# EAGLE design Transceiver (EAGLE 5.00)
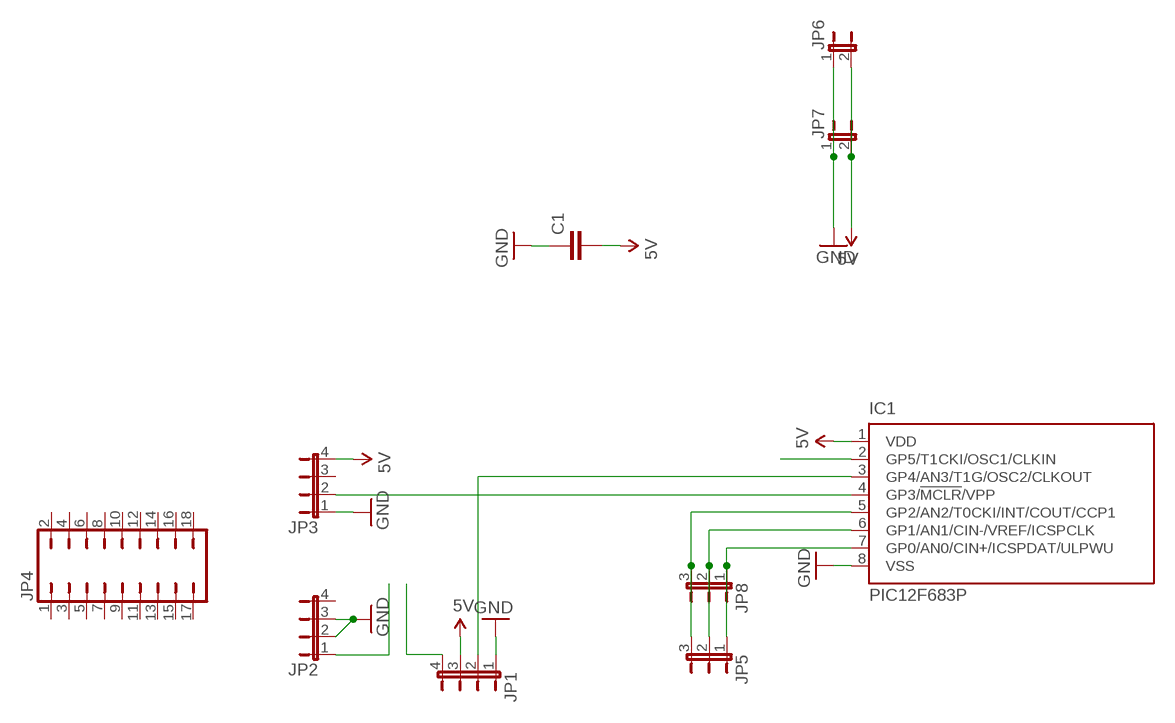
[diagram p0: schematic, sheet 1]

## Parts
C1  C-EU050-025X075  [C050-025X075]
IC1  PIC12F683P  [DIL8]
JP1  JP4E  [JP4]
JP2  JP4E  [JP4]
JP3  JP4E  [JP4]
JP4  JP9Q  [JP9Q]
JP5  JP2E  [JP2]
JP6  JP1E  [JP1]
JP7  JP1E  [JP1]
JP8  JP2E  [JP2]

## Nets
5V: C1.2 IC1.1(VDD) JP1.3 JP3.4 JP6.2 JP7.2
GND: C1.1 IC1.8(VSS) JP1.1 JP2.2 JP2.3 JP3.1 JP6.1 JP7.1
N$1: IC1.3(GP4/AN3/T1G/OSC2/CLKOUT) JP1.2
N$2: IC1.4(GP3/!MCLR!/VPP) JP3.2
N$3: IC1.5(GP2/AN2/T0CKI/INT/COUT/CCP1) JP5.3 JP8.3
N$4: IC1.6(GP1/AN1/CIN-/VREF/ICSPCLK) JP5.2 JP8.2
N$5: IC1.7(GP0/AN0/CIN+/ICSPDAT/ULPWU) JP5.1 JP8.1
N$6: IC1.2(GP5/T1CKI/OSC1/CLKIN)
N$7: JP2.1
N$8: JP1.4
Unconnected: JP2.4 JP3.3 JP4.1 JP4.2 JP4.3 JP4.4 JP4.5 JP4.6 JP4.7 JP4.8 JP4.9 JP4.10 JP4.11 JP4.12 JP4.13 JP4.14 JP4.15 JP4.16 JP4.17 JP4.18

## Library data of the parts
C1 = rcl:C-EU: CAPACITOR, European symbol
IC1 = microchip-6:PIC12F683: 8-Pin Flash-Based, 8-Bit CMOS Microcontrollers with nanoWatt Technology Source: http://ww1.microchip.com/downloads/en/DeviceDoc/41211D_.pdf
JP1-JP3 = jumper:JP4E: JUMPER
JP4 = jumper:JP9Q: JUMPER
JP5 JP8 = jumper:JP2E: JUMPER
JP6 JP7 = jumper:JP1E: JUMPER

## Board
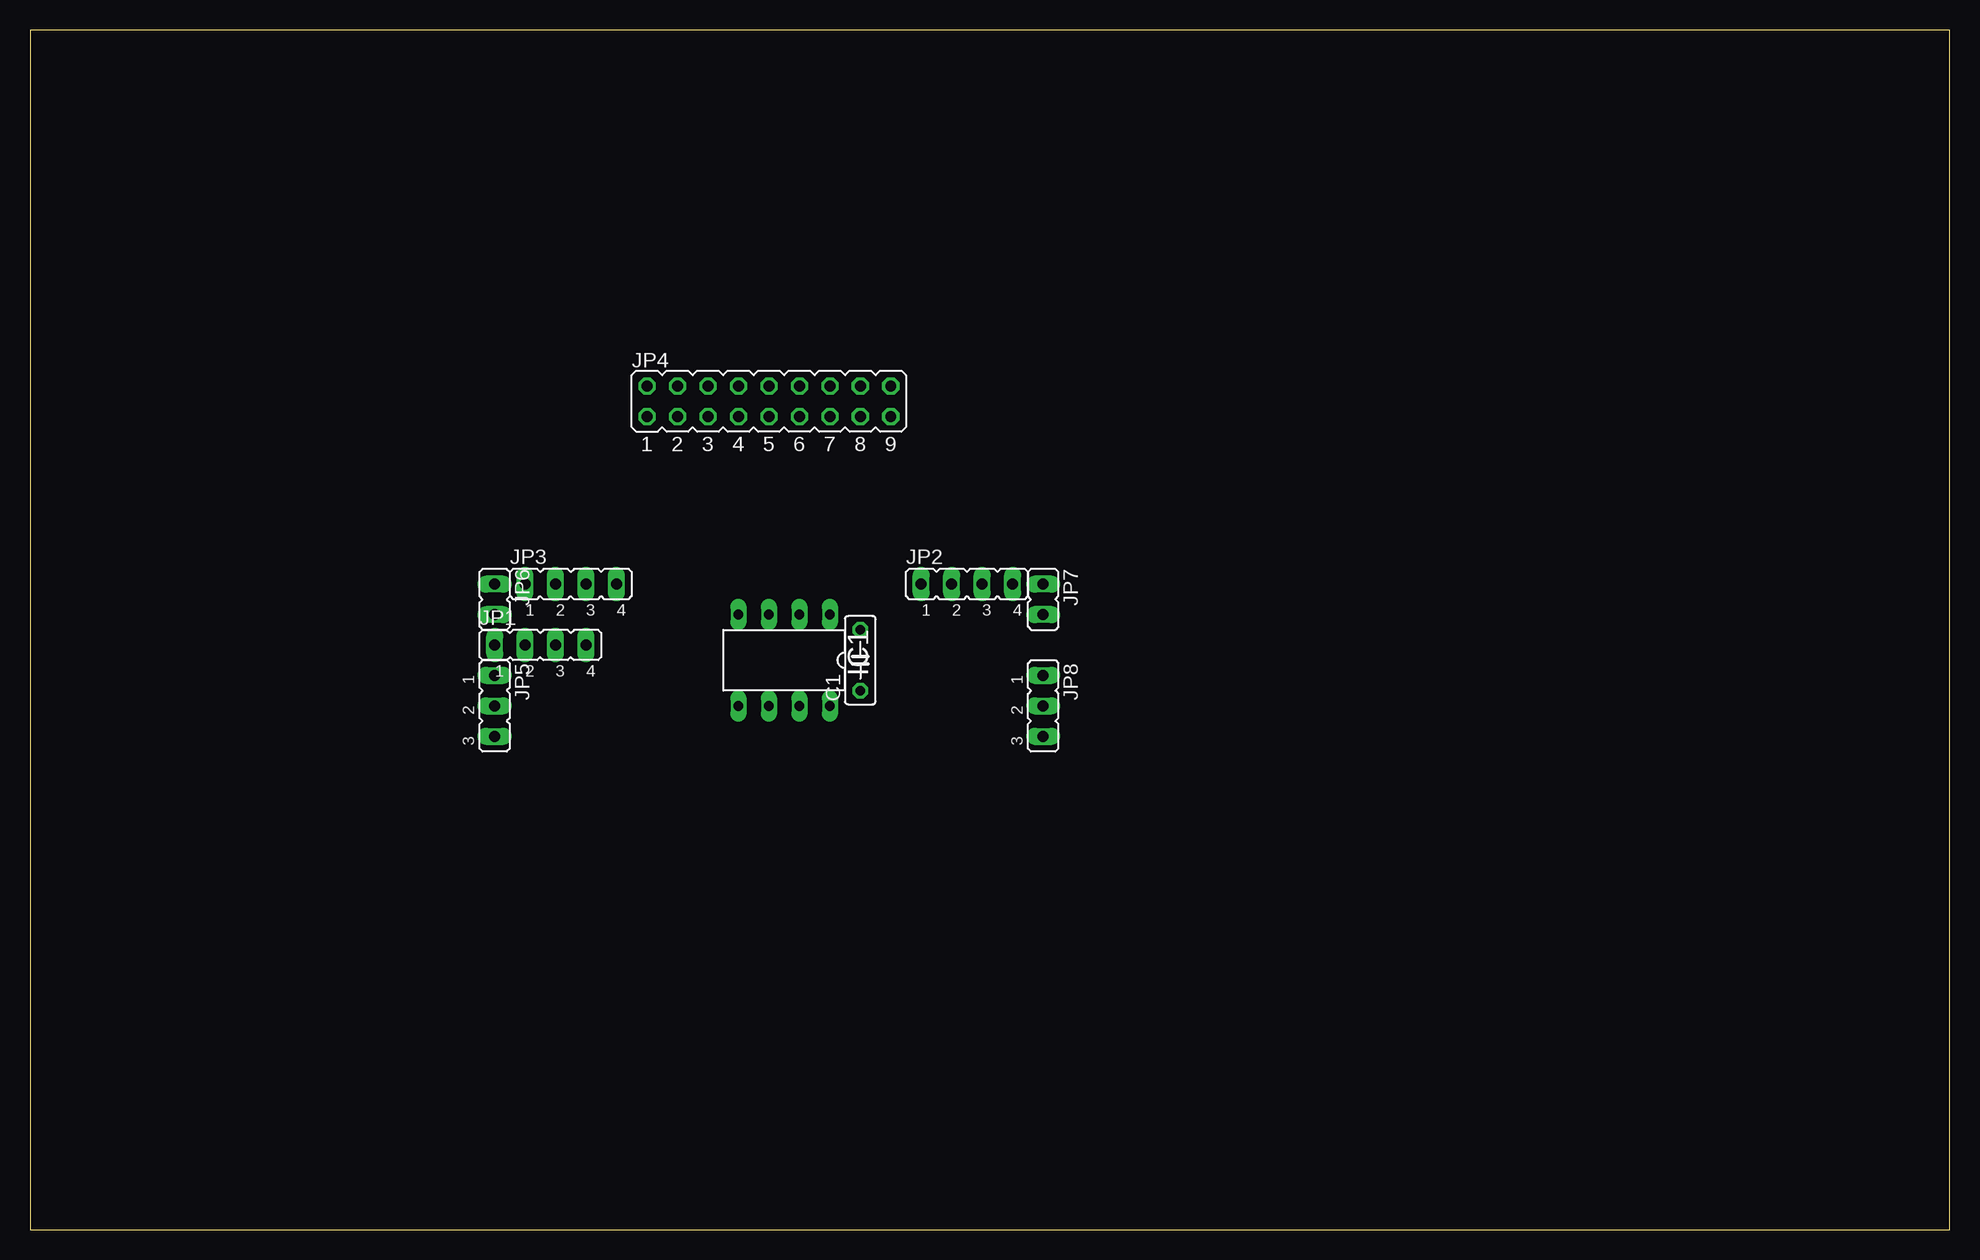
[diagram p1: board, top side]
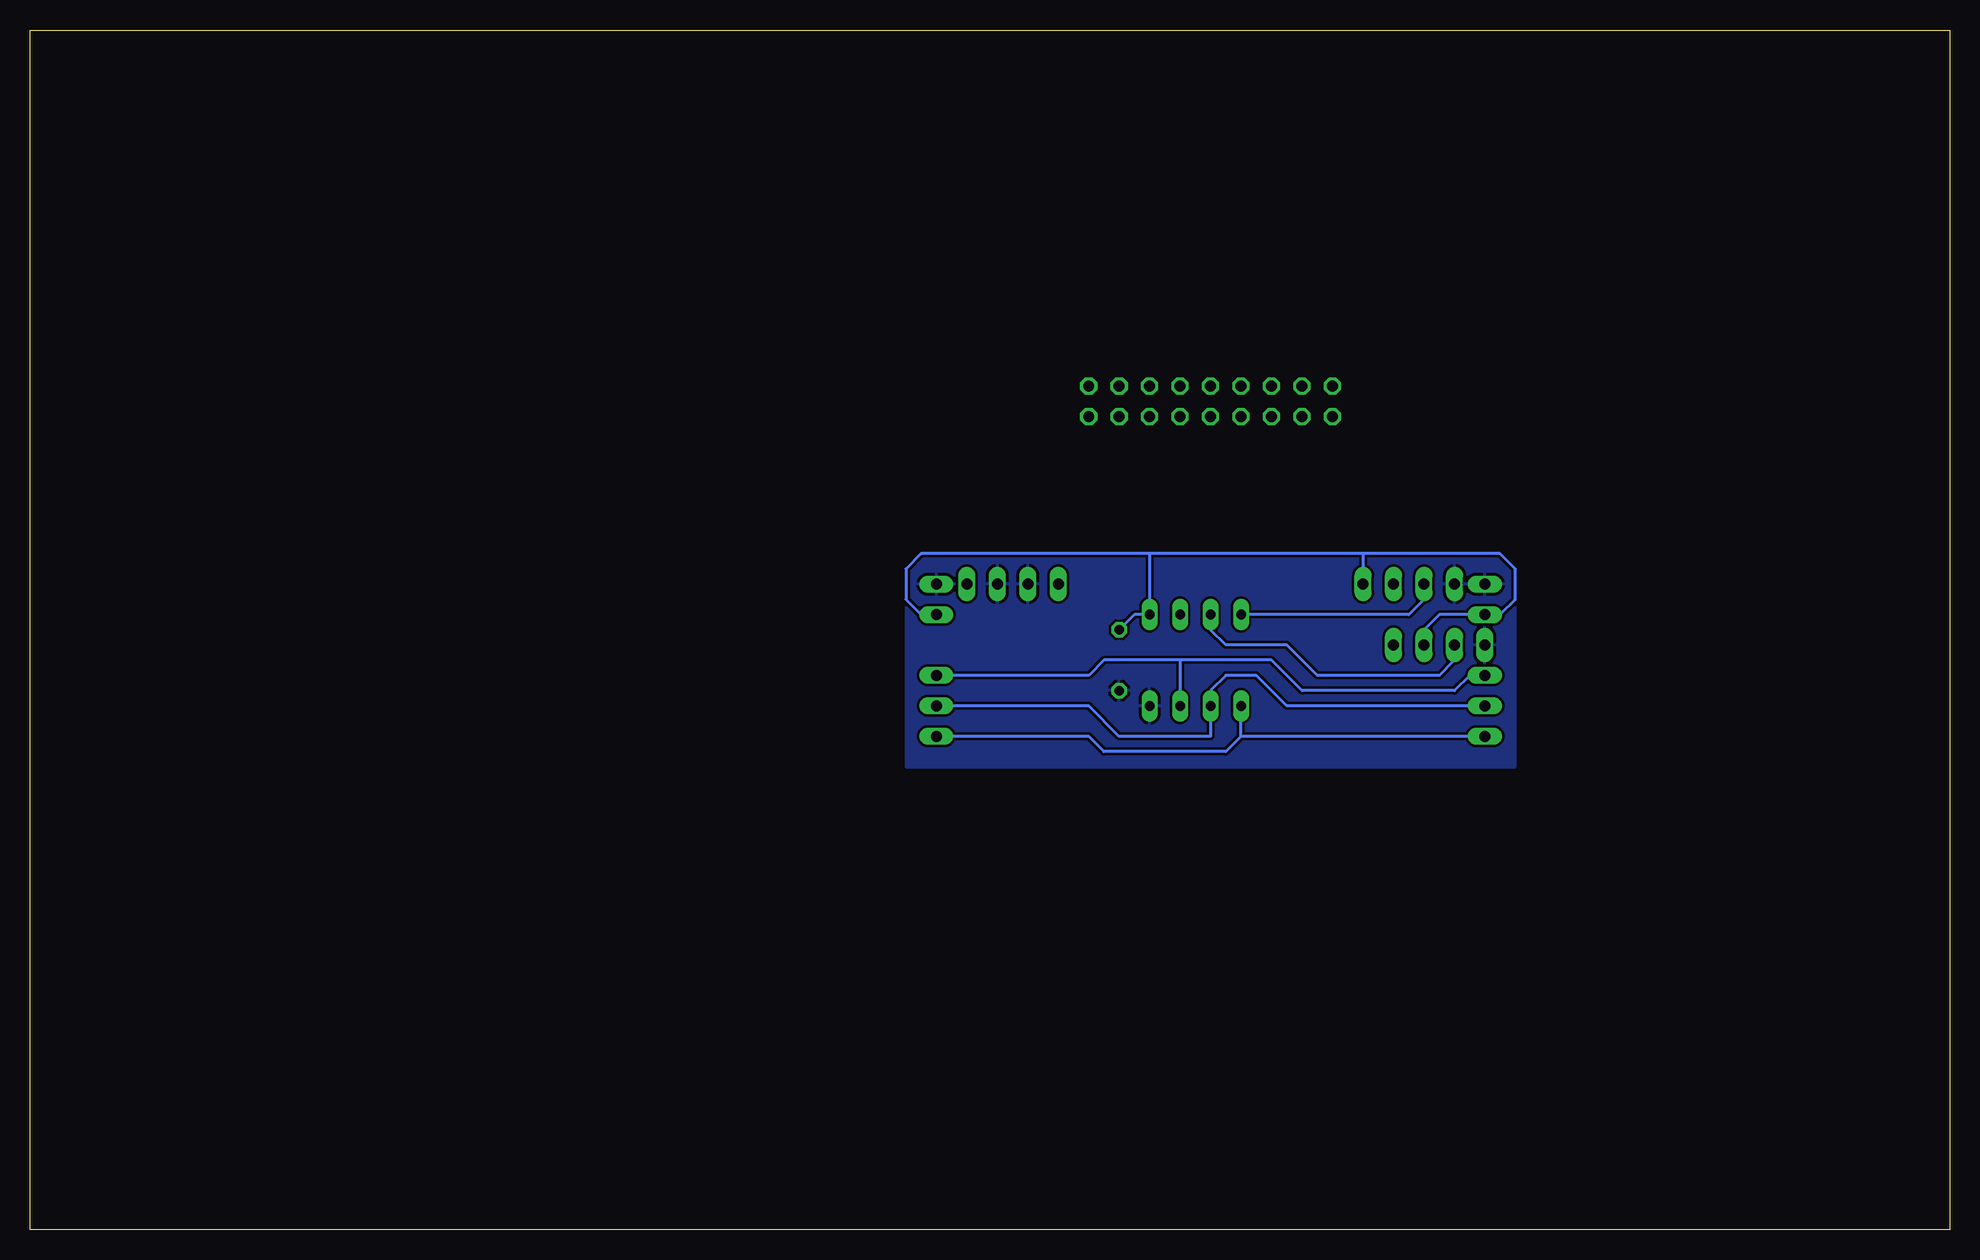
[diagram p2: board, bottom side, seen from below]

Size 160 x 100 mm. Coordinates in mm from the lower left corner, seen from the top.
Outline: 0,0 160,0 160,100 0,100 0,0
Copper layers (1*16): Top 0.035mm / dielectric 1.5mm / Bottom 0.035mm
Design rules "default": minimum track width 10mil, minimum drill 24mil, track to track 8mil, track to pad 8mil, pad to pad 8mil, via to via 8mil, smd to smd 8mil, copper to edge 40mil, drill to drill 8mil, minimum pad ring 10mil, minimum via ring 8mil, stop-mask expansion 4mil, vias tented up to drill 0mil, thermal gap 10mil

### Footprints (pad centres in the part's own frame; a part is rotated, then mirrored left to right if it is on the bottom)
C050-025X075 = drill 0.813 octagon: 1 -2.54,0; 2 2.54,0
DIL8 = drill 0.813 long: 1 -3.81,-3.81; 2 -1.27,-3.81; 3 1.27,-3.81; 4 3.81,-3.81; 5 3.81,3.81; 6 1.27,3.81; 7 -1.27,3.81; 8 -3.81,3.81
JP4 = drill 0.914 long: 1 -3.81,0; 2 -1.27,0; 3 1.27,0; 4 3.81,0
JP9Q = drill 0.914 octagon: 1 -10.16,-1.27; 2 -10.16,1.27; 3 -7.62,-1.27; 4 -7.62,1.27; 5 -5.08,-1.27; 6 -5.08,1.27; 7 -2.54,-1.27; 8 -2.54,1.27; 9 0,-1.27; 10 0,1.27; 11 2.54,-1.27; 12 2.54,1.27; 13 5.08,-1.27; 14 5.08,1.27; 15 7.62,-1.27; 16 7.62,1.27; 17 10.16,-1.27; 18 10.16,1.27
JP2 = drill 0.914 long: 1 -2.54,0; 2 0,0; 3 2.54,0
JP1 = drill 0.914 long: 1 0,-1.27; 2 0,1.27

### Placement (x,y rotation side)
C1  69.21,47.46 90 top
IC1  62.86,47.46 180 top
JP1  42.54,48.73 0 top
JP2  78.1,53.81 0 top
JP3  45.08,53.81 0 top
JP4  61.59,69.05 0 top
JP5  38.73,43.65 270 top
JP6  38.73,52.54 180 top
JP7  84.45,52.54 180 top
JP8  84.45,43.65 270 top

### Tracks (layer width: path | path; a pad name or v marks a point on that pad's centre or on a via)
5V
  Bottom 0.254: 66.67,56.35 85.72,56.35 86.99,55.08 86.99,52.54 85.72,51.27 JP7.2 | 48.89,56.35 37.46,56.35 36.19,55.08 36.19,52.54 37.46,51.27 JP6.2 42.54,51.27 43.81,50 JP1.3 | 48.89,56.35 JP3.4 | 48.89,56.35 66.67,56.35 | 66.67,56.35 IC1.1 67.94,51.27 C1.2
GND
  pour Bottom: 36.19,56.35 86.99,56.35 86.99,38.57 36.19,38.57
N$1
  Bottom 0.254: JP1.2 41.27,47.46 42.54,46.19 52.7,46.19 55.24,48.73 60.32,48.73 61.59,50 IC1.3
N$2
  Bottom 0.254: JP3.2 43.81,52.54 45.08,51.27 IC1.4
N$3
  Bottom 0.254: JP5.3 59.05,41.11 | 59.05,41.11 60.32,39.84 | 60.32,39.84 70.48,39.84 71.75,41.11 JP8.3 | 59.05,41.11 60.32,39.84 | 59.05,41.11 IC1.5
N$4
  Bottom 0.254: JP5.2 55.24,43.65 57.78,46.19 60.32,46.19 61.59,44.92 IC1.6 61.59,41.11 69.21,41.11 71.75,43.65 JP8.2
N$5
  Bottom 0.254: JP5.1 40,46.19 41.27,44.92 53.97,44.92 56.51,47.46 64.13,47.46 | 64.13,47.46 IC1.7 | JP8.1 71.75,46.19 70.48,47.46 64.13,47.46